# EAGLE design Dongle (EAGLE 7.5.0)
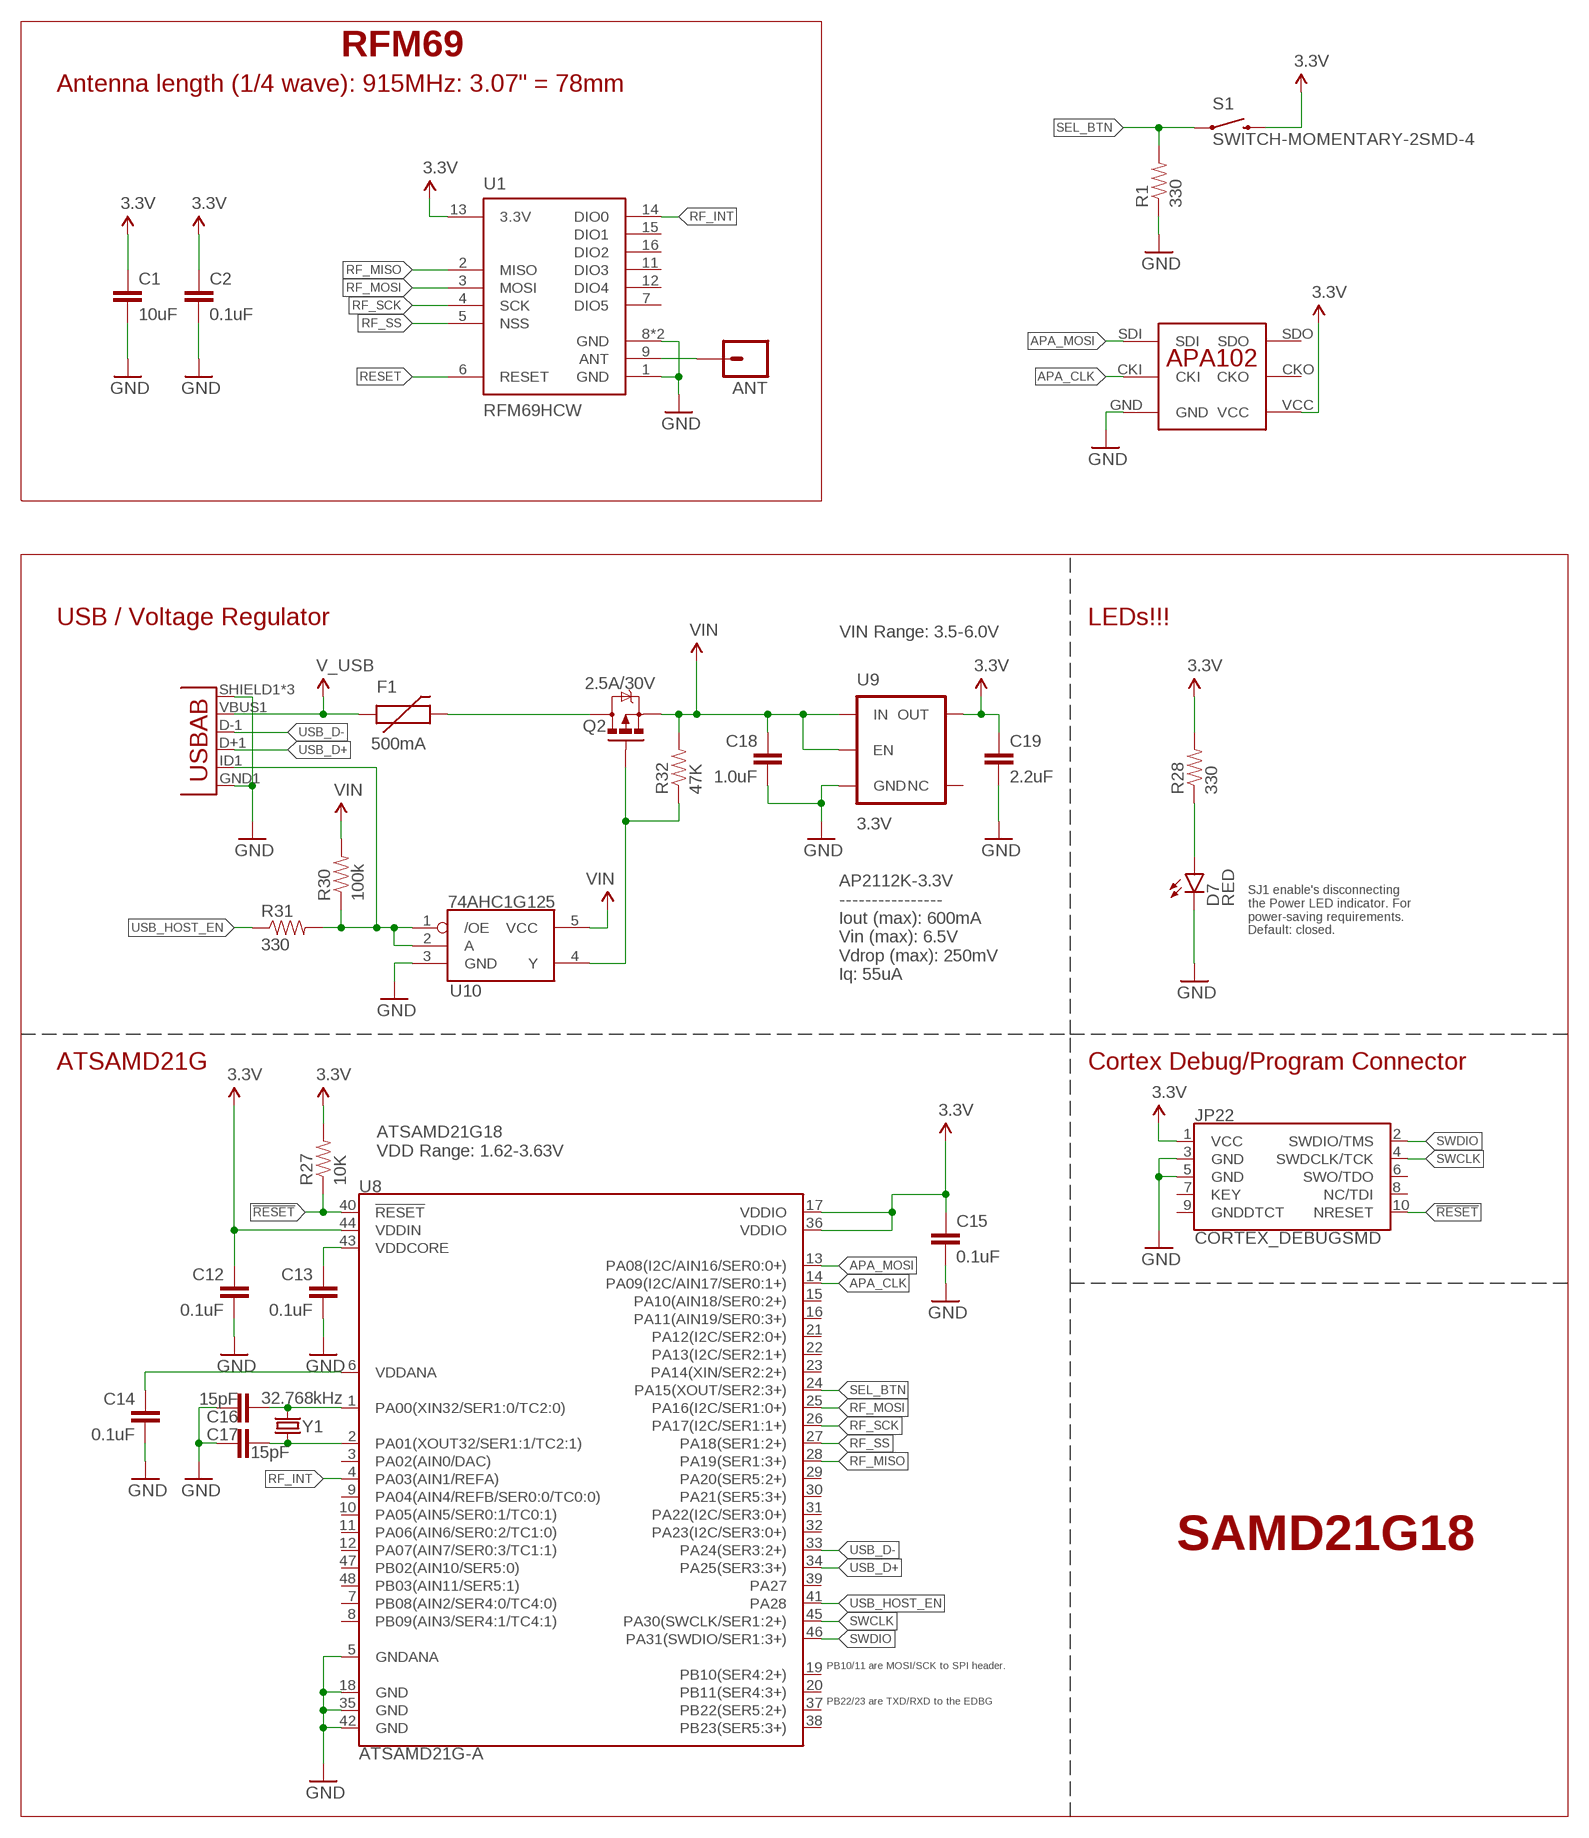
[diagram p0: schematic, sheet 1]

## Parts
ANT  M01PTH_NO_SILK_YES_STOP  [1X01_NO_SILK]
C1  10uF  10UF50V20%(1210)  [1210]
C2  0.1uF  0.1UF-25V(+80/-20%)(0603)  [0603-CAP@1]
C12  0.1uF  0.1UF-16V(+-10%)(0402)  [0402-CAP]
C13  0.1uF  0.1UF-16V(+-10%)(0402)  [0402-CAP]
C14  0.1uF  0.1UF-16V(+-10%)(0402)  [0402-CAP]
C15  0.1uF  0.1UF-16V(+-10%)(0402)  [0402-CAP]
C16  15pF  15PF-50V(+-5%)(0402)  [0402-CAP]
C17  15pF  15PF-50V(+-5%)(0402)  [0402-CAP]
C18  1.0uF  1.0UF-25V-+80/-20(0805)"  [0805-CAP]
C19  2.2uF  2.2UF-10V-20%(0603)  [0603-CAP]
D7  RED  LED-RED0603  [LED-0603]
F1  500mA  PTCSMD  [PTC-1206]
JP22  CORTEX_DEBUGSMD  [SAMTECH_FTSH-105-01]
JP23  USB-ABCONN-11794  [USB-AB-MICRO-SMD_V03]
Q2  2.5A/30V  MOSFET-PCHANNELDMG2307L  [SOT23-3]
R1  330  330OHM1/10W1%(0603)  [0603-RES]
R27  10K  10KOHM-1/10W-1%(0603)0603  [0603-RES]
R28  330  330OHM1/10W1%(0603)  [0603-RES]
R30  100k  100KOHM-1/10W-1%(0603)  [0603-RES]
R31  330  330OHM1/10W1%(0603)  [0603-RES]
R32  47K  47KOHM1/10W1%(0603)  [0603-RES]
S1  SWITCH-MOMENTARY-2SMD-4  [TACTILE_SWITCH_TALL]
U1  RFM69HCW  [RFM69HCW-XXXS2]
U8  ATSAMD21G-A  [TQFP-48]
U9  3.3V  V_REG_AP2112K-3.3V  [SOT23-5]
U10  74AHC1G125  [SOT23-5]
U$1  APA102  [APA102]
Y1  32.768kHz  CRYSTAL3.2X1.5MM  [CRYSTAL-SMD-3.2X1.5MM]

## Nets
3.3V: C1.1 C2.1 C12.1 C15.1 C19.1 JP22.1(VCC) R27.2 R28.2 S1.B2 U1.13(3.3V) U8.17(VDDIO) U8.36(VDDIO) U8.44(VDDIN) U9.5(OUT) U$1.VCC
!RESET: JP22.10(NRESET) R27.1 U8.40(!RESET!)
ANT: ANT.1 U1.9(ANT)
APA_CLK: U8.14(PA09(I2C/AIN17/SER0:1+)) U$1.CKI
APA_MOSI: U8.13(PA08(I2C/AIN16/SER0:0+)) U$1.SDI
GND: C1.2 C2.2 C12.2 C13.2 C14.2 C15.2 C16.1 C17.2 C18.2 C19.2 D7.C JP22.3(GND) JP22.5(GND) JP23.GND1(GND) JP23.SHIELD1(SHIELD) JP23.SHIELD2(SHIELD) JP23.SHIELD3(SHIELD) R1.1 U1.1(GND) U1.8(GND) U1.10(GND) U8.5(GNDANA) U8.18(GND) U8.35(GND) U8.42(GND) U9.2(GND) U10.3(GND) U$1.GND
N$10: C16.2 U8.1(PA00(XIN32/SER1:0/TC2:0)) Y1.P$2
N$13: C17.1 U8.2(PA01(XOUT32/SER1:1/TC2:1)) Y1.P$1
N$14: D7.A R28.1
N$18: F1.2 Q2.3(D)
N$19: JP23.ID1(USBID) R30.1 R31.2 U10.1(/OE) U10.2(A)
N$20: Q2.1(G) R32.1 U10.4(Y)
RESET: U1.6(RESET)
RF_INT: U1.14(DIO0) U8.4(PA03(AIN1/REFA))
RF_MISO: U1.2(MISO) U8.28(PA19(SER1:3+))
RF_MOSI: U1.3(MOSI) U8.25(PA16(I2C/SER1:0+))
RF_SCK: U1.4(SCK) U8.26(PA17(I2C/SER1:1+))
RF_SS: U1.5(NSS) U8.27(PA18(SER1:2+))
SEL_BTN: R1.2 S1.A2 U8.24(PA15(XOUT/SER2:3+))
SWCLK: JP22.4(SWDCLK/TCK) U8.45(PA30(SWCLK/SER1:2+))
SWDIO: JP22.2(SWDIO/TMS) U8.46(PA31(SWDIO/SER1:3+))
USB_D+: JP23.D+1(D+) U8.34(PA25(SER3:3+))
USB_D-: JP23.D-1(D-) U8.33(PA24(SER3:2+))
USB_HOST_EN: R31.1 U8.41(PA28)
V_USB: F1.1 JP23.VBUS1(VBUS)
VDDANA: C14.1 U8.6(VDDANA)
VDDCORE: C13.1 U8.43(VDDCORE)
VIN: C18.1 Q2.2(S) R30.2 R32.2 U9.1(IN) U9.3(EN) U10.5(VCC)
Unconnected: JP22.6(SWO/TDO) JP22.7(KEY) JP22.8(NC/TDI) JP22.9(GNDDTCT) U1.7(DIO5) U1.11(DIO3) U1.12(DIO4) U1.15(DIO1) U1.16(DIO2) U8.3(PA02(AIN0/DAC)) U8.7(PB08(AIN2/SER4:0/TC4:0)) U8.8(PB09(AIN3/SER4:1/TC4:1)) U8.9(PA04(AIN4/REFB/SER0:0/TC0:0)) U8.10(PA05(AIN5/SER0:1/TC0:1)) U8.11(PA06(AIN6/SER0:2/TC1:0)) U8.12(PA07(AIN7/SER0:3/TC1:1)) U8.15(PA10(AIN18/SER0:2+)) U8.16(PA11(AIN19/SER0:3+)) U8.19(PB10(SER4:2+)) U8.20(PB11(SER4:3+)) U8.21(PA12(I2C/SER2:0+)) U8.22(PA13(I2C/SER2:1+)) U8.23(PA14(XIN/SER2:2+)) U8.29(PA20(SER5:2+)) U8.30(PA21(SER5:3+)) U8.31(PA22(I2C/SER3:0+)) U8.32(PA23(I2C/SER3:0+)) U8.37(PB22(SER5:2+)) U8.38(PB23(SER5:3+)) U8.39(PA27) U8.47(PB02(AIN10/SER5:0)) U8.48(PB03(AIN11/SER5:1)) U9.4(NC) U$1.CKO U$1.SDO

## Notes on the sheet
- RFM69
- Antenna length (1/4 wave): 915MHz: 3.07" = 78mm
- USB / Voltage Regulator | LEDs!!!
- VIN Range: 3.5-6.0V
- AP2112K-3.3V
  ----------------
  Iout (max): 600mA 
  Vin (max): 6.5V
  Vdrop (max): 250mV
  Iq: 55uA
- SJ1 enable's disconnecting
  the Power LED indicator. For
  power-saving requirements.
  Default: closed.
- ATSAMD21G | Cortex Debug/Program Connector
- ATSAMD21G18
  VDD Range: 1.62-3.63V
- SAMD21G18
- PB10/11 are MOSI/SCK to SPI header.
- PB22/23 are TXD/RXD to the EDBG

## Library data of the parts
ANT = SparkFun-Connectors:M01: Header 1 Standard 1-pin 0.1" header. Use with straight break away headers (SKU : PRT-00116), right angle break away headers (PRT-00553), swiss pins (PRT-00743), machine pins (PRT-00117), and female headers (PRT-00115). SMTSO-256-ET is a "flush mount" nut for a 4-40 screw. The older package used to be too tight, and did not allow it to sit properly thru the drill hit. The latest (0.165DIA) fits nice and snug.
C1 = SparkFun-Capacitors:10UF50V20%(1210): CAP-09824; PROD_ID: CAP-09824
C2 = SparkFun-Capacitors:0.1UF-25V(+80/-20%)(0603): CAP-00810 Ceramic Standard decoupling cap; PROD_ID: CAP-00810
C12-C15 = SparkFun-Capacitors:0.1UF-16V(+-10%)(0402); PROD_ID: CAP-12416
C16 C17 = samd21-temp:15PF-50V(+-5%)(0402); PROD_ID: CAP-13063
C18 = SparkFun-Capacitors:1.0UF-25V-+80/-20(0805): CAP-11625; PROD_ID: CAP-11625
C19 = SparkFun-Capacitors:2.2UF-10V-20%(0603): CAP-07888; PROD_ID: CAP-07888
D7 = SparkFun-LED:LED-RED: Assorted Red LEDs LilyPad 1206- DIO-09912 1206- DIO-00809 0603- DIO-00819 "SMART" means more efficient and expensive; PROD_ID: DIO-00819
F1 = SparkFun-PowerIC:PTC: Resettable Fuse PTC Resettable Fuse. Spark Fun Electronics SKU : COM-08357; PROD_ID: RES-11150
JP22 = SparkFun-Connectors:CORTEX_DEBUG: Cortex Debug Connector Datasheet <http://infocenter.arm.com/help/topic/com.arm.doc.faqs/attached/13634/cortex_debug_connectors.pdf>
JP23 = SparkFun-Connectors:USB-AB: This is a USB AB connector that is compatible with USB OTG. i.e. this connector can serve as a host or device; PROD_ID: CONN-11794
Q2 = SparkFun-DiscreteSemi:MOSFET-PCHANNEL: Generic PMOSFET IRLML2244 - TRANS-11153 (SOT-23 -20V -4.3A) (1.Gate 2.Source 3.Drain) FQP27P06 - COM-10349 <http://www.sparkfun.com/products/10349> (TO-220 -60V -27A) (1.Gate 2.Source 3.Drain); PROD_ID: TRANS-11308
R1 R28 R31 = SparkFun-Resistors:330OHM1/10W1%(0603): RES-00818; PROD_ID: RES-00818
R27 = SparkFun-Resistors:10KOHM-1/10W-1%(0603): RES-00824; PROD_ID: RES-00824
R30 = SparkFun-Resistors:100KOHM-1/10W-1%(0603): RES-07828; PROD_ID: RES-07828
R32 = SparkFun-Resistors:47KOHM1/10W1%(0603): RES-07871; PROD_ID: RES-07871
S1 = SparkFun-Electromechanical:SWITCH-MOMENTARY-2: Various NO switches- pushbuttons, reed, etc; PROD_ID: SWCH-11966
U1 = mike-temp:RFM69H
U8 = samd21-temp:ATSAMD21G: Atmel SAMD21G SMART ARM-Based Microcontroller The Atmel ® | SMART ™ SAM D21 is a series of low-power microcontrollers using the 32-bit ARM ® Cortex ® -M0+ processor, and ranging from 32- to 64-pins with up to 256KB Flash and 32KB of SRAM. The SAM D21 devices operate at a maximum frequency of 48MHz and reach 2.46 CoreMark/MHz. They are designed for simple and intuitive migration with identical peripheral modules, hex compatible code, identical linear address map and pin compatible migration paths between all devices in the product series. All devices include intelligent and flexible peripherals, Atmel Event System for inter-peripheral signaling, and support for capacitive touch button, slider and wheel user interfaces.; PROD_ID: IC-13064
U9 = SparkFun-PowerIC:V_REG_AP2112: AP2112 - 600mA CMOS LDO Regulator w/ Enable The AP2112 is CMOS process low dropout linear regulator with enable function, the regulator delivers a guaranteed 600mA (min.) continuous load current. Features Output Voltage Accuracy: ±1.5% Output Current: 600mA (Min.) Foldback Short Current Protection: 50mA Enable Function to Turn ON/OFF VOUT Low Dropout Voltage (3.3V): 250mV (Typ.) @IOUT=600mA Excellent Load Regulation: 0.2%/A (Typ.) Excellent Line Regulation: 0.02%/V (Typ.) Low Quiescent Current: 55μA (Typ.) Low Standby Current: 0.01μA (Typ.) Low Output Noise: 50μVRMS PSRR: 100Hz -65dB, 1kHz -65dB OTSD Protection Stable with 1.0μF Flexible Cap: Ceramic, Tantalum and Aluminum Electrolytic Operation Temperature Range: -40°C to 85°C ESD: MM 400V, HBM 4000V; PROD_ID: VREG-12457
U10 = SparkFun-DigitalIC:74AHC1G125: Single bus buffer gate with 3-state output; PROD_ID: IC-11920
U$1 = SAUVE:APA102
Y1 = samd21-temp:CRYSTAL: Various standard crystals. Proven footprints.; PROD_ID: XTAL-13062

## Board
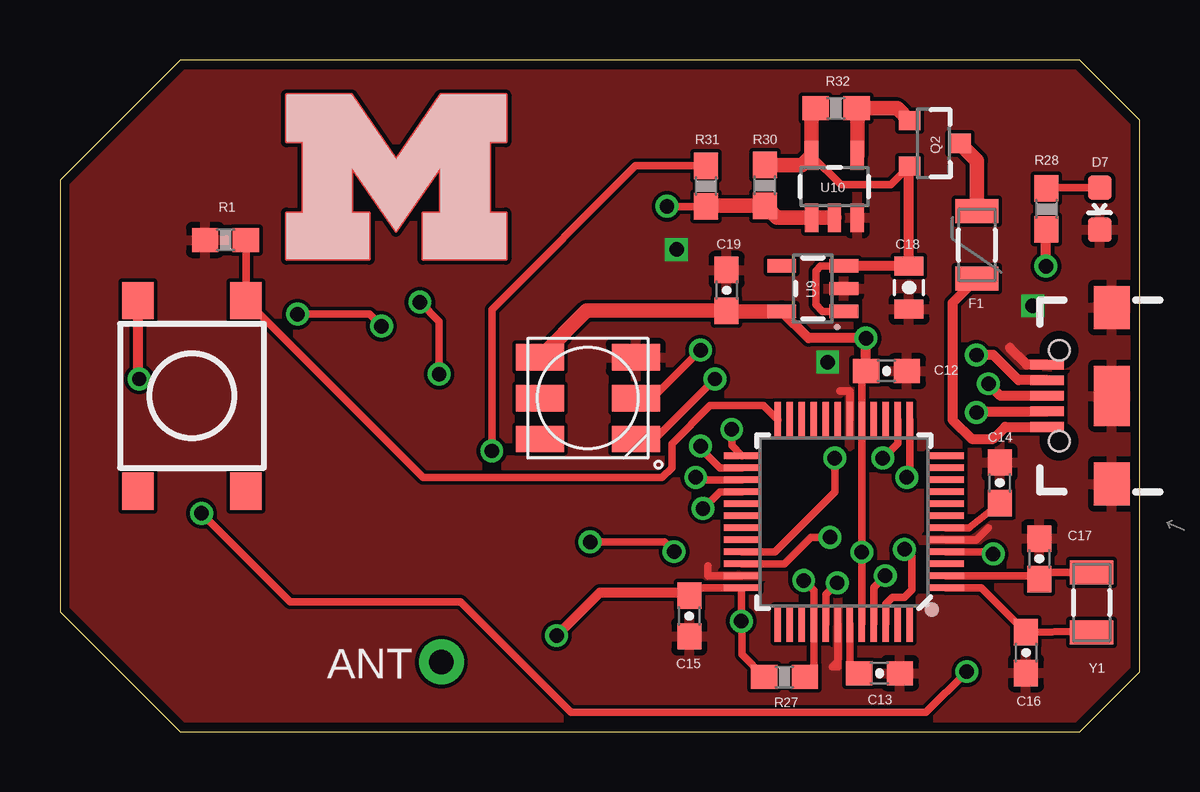
[diagram p1: board, top side]
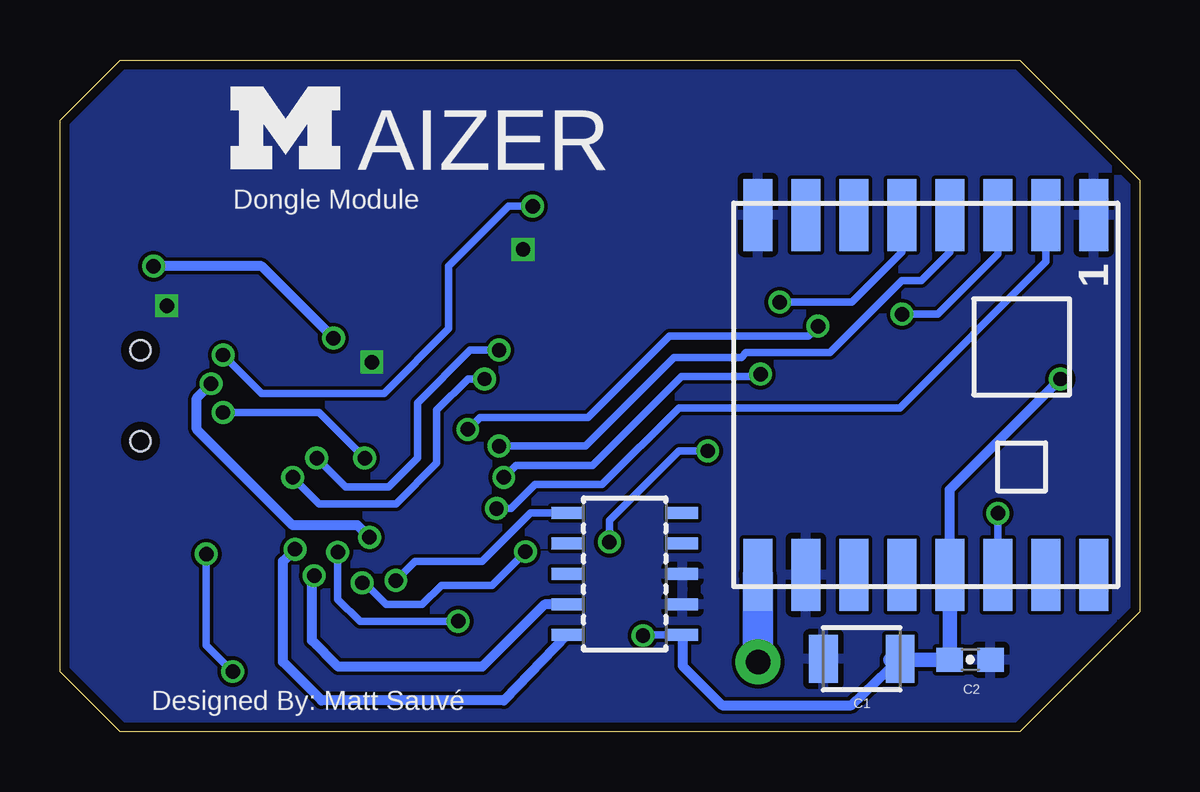
[diagram p2: board, bottom side, seen from below]

Size 45 x 28 mm. Coordinates in mm from the lower left corner, seen from the top.
Outline: 0,23 0,5 5,0 42.5,0 45,2.5 45,25.5 42.5,28 5,28 0,23
Copper layers (1*16): Top 0.0356mm / dielectric 1.5011mm / Bottom 0.0356mm
Design rules "oshpark-2layer": minimum track width 6mil, minimum drill 13mil, track to track 6mil, track to pad 6mil, pad to pad 6mil, via to via 6mil, smd to smd 6mil, copper to edge 15mil, drill to drill 6mil, minimum pad ring 7mil, minimum via ring 7mil, stop-mask expansion 2.5mil, vias tented up to drill 0mil, thermal gap 10mil

### Footprints (pad centres in the part's own frame; a part is rotated, then mirrored left to right if it is on the bottom)
1X01_NO_SILK = drill 1.016 pad 1.88: 1 0,0
1210 = smd 1.2 x 2: 1 -1.6,0; 2 1.6,0
0603-CAP = smd 1.1 x 1: 1 -0.85,0; 2 0.85,0
0805-CAP = smd 0.8 x 1.2: 1 -0.9,0; 2 0.9,0
LED-0603 = smd 1 x 1: A 0,-0.877; C 0,0.877
PTC-1206 = smd 1 x 1.8: 1 -1.4,0; 2 1.4,0
SAMTECH_FTSH-105-01 = smd 0.508 x 1.27: 1 -2.54,-2.413; 2 -2.54,2.413; 3 -1.27,-2.413; 4 -1.27,2.413; 5 0,-2.413; 6 0,2.413; 7 1.27,-2.413; 8 1.27,2.413; 9 2.54,-2.413; 10 2.54,2.413
USB-AB-MICRO-SMD_V03 = smd 1.4 x 0.4: D+1 2.7,0; D-1 2.7,0.65; GND1 2.7,-1.3; ID1 2.7,-0.65; VBUS1 2.7,1.3 | smd 1.5 x 1.8: SHIELD1 0,3.68; SHIELD3 0,-3.68 | smd 1.5 x 2.5: SHIELD2 0,0 | hole 0.85: 2.2,1.9; 2.2,-1.9
SOT23-3 = smd 0.8 x 0.9: 1 -0.95,-1; 2 0.95,-1; 3 0,1.1
0603-RES = smd 1.1 x 1: 1 -0.85,0; 2 0.85,0
TACTILE_SWITCH_TALL = smd 1.55 x 1.3: A1 -3.975,-2.25; A2 3.975,-2.25; B1 -3.975,2.25; B2 3.975,2.25
RFM69HCW-XXXS2 = smd 3 x 1.2: 1 -7.5,7; 2 -7.5,5; 3 -7.5,3; 4 -7.5,1; 5 -7.5,-1; 6 -7.5,-3; 7 -7.5,-5; 8 -7.5,-7; 9 7.5,-7; 10 7.5,-5; 11 7.5,-3; 12 7.5,-1; 13 7.5,1; 14 7.5,3; 15 7.5,5; 16 7.5,7
TQFP-48 = smd 1.5 x 0.28: 1 -4.25,2.75; 2 -4.25,2.25; 3 -4.25,1.75; 4 -4.25,1.25; 5 -4.25,0.75; 6 -4.25,0.25; 7 -4.25,-0.25; 8 -4.25,-0.75; 9 -4.25,-1.25; 10 -4.25,-1.75; 11 -4.25,-2.25; 12 -4.25,-2.75; 25 4.25,-2.75; 26 4.25,-2.25; 27 4.25,-1.75; 28 4.25,-1.25; 29 4.25,-0.75; 30 4.25,-0.25; 31 4.25,0.25; 32 4.25,0.75; 33 4.25,1.25; 34 4.25,1.75; 35 4.25,2.25; 36 4.25,2.75 | smd 0.28 x 1.5: 13 -2.75,-4.25; 14 -2.25,-4.25; 15 -1.75,-4.25; 16 -1.25,-4.25; 17 -0.75,-4.25; 18 -0.25,-4.25; 19 0.25,-4.25; 20 0.75,-4.25; 21 1.25,-4.25; 22 1.75,-4.25; 23 2.25,-4.25; 24 2.75,-4.25; 37 2.75,4.25; 38 2.25,4.25; 39 1.75,4.25; 40 1.25,4.25; 41 0.75,4.25; 42 0.25,4.25; 43 -0.25,4.25; 44 -0.75,4.25; 45 -1.25,4.25; 46 -1.75,4.25; 47 -2.25,4.25; 48 -2.75,4.25
SOT23-5 = smd 0.55 x 1.2: 1 -0.95,-1.3; 2 0,-1.3; 3 0.95,-1.3; 4 0.95,1.3; 5 -0.95,1.3
APA102 = smd 2 x 1.1: CKI -2,0; CKO 2,0; GND -2,-1.7; SDI -2,1.7; SDO 2,1.7; VCC 2,-1.7
CRYSTAL-SMD-3.2X1.5MM = smd 1 x 1.8: P$1 -1.25,0; P$2 1.25,0

### Placement (x,y rotation side)
ANT  15.9,2.9 0 top
C1  11.58,3.03 180 bottom
C2  0.1uF  [0603-CAP]  7.06,3 0 bottom
C12  0.1uF  [0603-CAP]  34.45,15.03 0 top
C13  0.1uF  [0603-CAP]  34.16,2.43 0 top
C14  0.1uF  [0603-CAP]  39.17,10.37 90 top
C15  0.1uF  [0603-CAP]  26.23,4.82 270 top
C16  15pF  [0603-CAP]  40.27,3.29 90 top
C17  15pF  [0603-CAP]  40.83,7.2 90 top
C18  35.39,18.51 270 top
C19  27.79,18.4 90 top
D7  GREEN  [LED-0603]  43.34,21.8 180 top
F1  38.22,20.29 90 top
JP22  21.46,6.57 90 bottom
JP23  43.85,14 180 top
Q2  36.41,24.52 270 top
R1  6.9,20.5 0 top
R27  30.2,2.28 180 top
R28  41.12,21.79 270 top
R30  29.38,22.77 90 top
R31  26.92,22.74 270 top
R32  32.35,25.98 180 top
S1  5.5,14 90 top
U1  8.91,14.04 270 bottom
U8  32.67,8.75 180 top
U9  31.38,18.47 90 top
U10  32.28,22.72 0 top
U$1  22,13.9 180 top
U$2  [BLOCK-M-5MM]  35.6,25.1 0 bottom
U$4  [BLOCK-M-10MM-MASK]  14,23 0 top
Y1  43,5.38 270 top

### Tracks (layer width: path | path; a pad name or v marks a point on that pad's centre or on a via)
3.3V  (via drill 0.6)
  Top 0.305: 26.53,6 C15.1 26.56,6 U8.36 28.4,5.98 v28.4,4.6 28.42,4.58 28.42,3.21 R27.2 | U8.44 v33.42,7.48 33.4,7.5 33.42,7.52 U8.17 33.42,15.08 33.64,15.3 33.6,15.34
  Top 0.406: v20.7,4 22.5,5.8 26.1,5.8 C15.1 | v3.3,14.7 3.25,14.75 S1.B2 | 30.08,17.42 U9.5 31.2,16.4 v33.6,16.4 33.6,15.34 | v41.1,19.4 41.1,20.92 R28.2 | 33.64,15.3 C12.1
  Top 0.61: U9.5 27.82,17.52 C19.1 21.95,17.55 U$1.VCC
  Bottom 0.305: v33.42,7.48 33.42,5.52 32.5,4.6 v28.4,4.6 | v20.7,4 20.7,4.03 JP22.1
  Bottom 0.406: JP22.1 19.05,2.75 17.4,1.1 12.01,1.1 C1.1 | U1.13 7.91,10.09 v3.3,14.7 | v33.6,16.4 36.6,19.4 v41.1,19.4
  Bottom 0.61: U1.13 C2.1 10.38,3 C1.1
!RESET  (via drill 0.6)
  Top 0.305: R27.1 31.42,2.65 U8.40 31.42,5.88 v31,6.3
  Bottom 0.305: JP22.10 25.39,9.11 27.4,7.1 30.2,7.1 v31,6.3
ANT
  Bottom 1.27: U1.9 15.91,3.39 arc90 ANT.1
APA_CLK  (via drill 0.6)
  Top 0.305: U8.14 34.92,12.02 v34.3,11.4 | v26.7,15.9 24.7,13.9 U$1.CKI
  Bottom 0.305: v26.7,15.9 27.9,15.9 30.1,13.7 30.1,11.4 31.3,10.2 33.1,10.2 v34.3,11.4
APA_MOSI  (via drill 0.6)
  Top 0.305: U8.13 35.42,10.72 v35.3,10.6 | v27.3,14.7 24.8,12.2 U$1.SDI
  Bottom 0.305: v27.3,14.7 28,14.7 29.3,13.4 29.3,11.2 31,9.5 34.2,9.5 v35.3,10.6
GND  (via drill 0.6)
  Top 0.305: U8.42 32.42,2.7 32.2,2.7 32.4,2.9 | U8.35 27,6.5 27,6.9 | U8.18 32.92,14.2 32.5,14.2 | U8.5 38.2,8 38.7,8.5
  Top 0.406: JP23.GND1 40.3,15.3 39.6,16
  other vias: 25.7,20.1 40.55,17.75 32,15.4
  pour Bottom: 42.5,0 5,0 0,5 0,23 5,28 42.5,28 45,25.5 45,2.5
  pour Top: 42.5,0 5,0 0,5 0,23 5,28 42.5,28 45,25.5 45,2.5
N$10
  Top 0.305: Y1.P$2 42.56,4.17 C16.2 38.41,6 U8.1
N$13
  Top 0.305: Y1.P$1 41.14,6.63 C17.1 40.41,6.5 U8.2
N$14
  Top 0.305: R28.1 41.16,22.68 D7.A
N$18
  Top 0.61: F1.2 38.22,23.81 Q2.3
N$19  (via drill 0.6)
  Top 0.305: R31.2 v25.31,21.89 v25.3,21.9
  Top 0.406: JP23.ID1 39.95,14.65 38.9,15.7 v38.2,15.7
  Top 0.61: R31.2 26.95,21.92 R30.1 29.88,21.42 U10.1 U10.2
  Bottom 0.305: v38.2,15.7 36.6,14.1 31.5,14.1 28.8,16.8 28.8,19.4 26.3,21.9 v25.3,21.9
N$20
  Top 0.61: Q2.1 34.9,25.98 R32.1 33.23,25.95 U10.4
RF_INT  (via drill 0.6)
  Top 0.305: v38.9,7.4 38.8,7.5 U8.4 | v5.9,9.1 9.6,5.4 16.7,5.4 21.3,0.8 36.1,0.8 v37.8,2.5
  Bottom 0.305: U1.14 v5.9,9.1 | v37.8,2.5 38.9,3.6 v38.9,7.4
RF_MISO  (via drill 0.6)
  Top 0.305: U8.28 27.5,10 v26.8,9.3
  Bottom 0.305: v26.8,9.3 26.2,9.3 25.2,10.3 22.4,10.3 19.2,13.5 10,13.5 3.9,19.6 U1.2
RF_MOSI  (via drill 0.6)
  Top 0.305: U8.25 28,11.92 v28,12.6 | v9.9,17.4 12.9,17.4 v13.4,16.9
  Bottom 0.305: v28,12.6 27.5,13.1 23,13.1 19.6,16.5 13.8,16.5 v13.4,16.9 | v9.9,17.4 8.4,17.4 5.9,19.9 U1.3
RF_SCK  (via drill 0.6)
  Top 0.305: U8.26 27.5,11 26.7,11.8 v26.7,11.9
  Bottom 0.305: v26.7,11.9 23.1,11.9 19.4,15.6 16.6,15.6 16.4,15.8 12.9,15.8 9.9,18.8 9.1,18.8 7.9,20 U1.4
RF_SS  (via drill 0.6)
  Top 0.305: U8.27 26.6,10.5 v26.5,10.6 | v15.8,14.9 15.8,17.1 v15,17.9
  Bottom 0.305: v26.5,10.6 26,11.1 22.8,11.1 19.1,14.8 15.9,14.8 v15.8,14.9 | U1.5 9.9,20 12,17.9 v15,17.9
SEL_BTN
  Top 0.305: R1.2 S1.A2 15.12,10.6 25.1,10.6 25.5,11 25.5,12 27.1,13.6 29.32,13.6 U8.24
SWCLK  (via drill 0.6)
  Top 0.305: U8.45 33.92,6.02 v34.4,6.5
  Bottom 0.406: JP22.4 24.8,5.3 27.4,2.7 33.4,2.7 34.5,3.8 34.5,6.4 v34.4,6.5
SWDIO  (via drill 0.6)
  Top 0.305: U8.46 34.42,5.32 34.7,5.6 35.2,5.6 35.5,5.9 35.5,7.3 v35.2,7.6
  Bottom 0.406: JP22.2 26.5,1.3 34.1,1.3 35.7,2.9 35.7,7.1 v35.2,7.6
USB_D+  (via drill 0.6)
  Top 0.305: U8.34 30.2,7 31.3,8.1 v32.1,8.1
  Top 0.406: JP23.D+1 39.2,14 v38.7,14.5
  Bottom 0.406: v32.1,8.1 32.6,8.6 35.3,8.6 39.3,12.6 39.3,13.9 v38.7,14.5
USB_D-  (via drill 0.6)
  Top 0.305: U8.33 29.8,7.5 32.3,10 v32.3,11.4
  Top 0.406: v38.2,13.3 38.25,13.35 JP23.D-1
  Bottom 0.305: v38.2,13.3 34.2,13.3 v32.3,11.4
USB_HOST_EN  (via drill 0.6)
  Top 0.305: U8.41 31.92,5.72 v32.4,6.2 | R31.1 23.99,23.59 18,17.6 v18,11.7 | v22.1,7.9 25.2,7.9 v25.6,7.5
  Bottom 0.305: v25.6,7.5 27,6.1 29.1,6.1 29.9,5.3 31.4,5.3 32.3,6.2 v32.4,6.2 | v18,11.7 19.2,11.7 22.1,8.8 v22.1,7.9
V_USB
  Top 0.406: F1.1 37.2,17.87 37.2,13 38,12.2 38.9,12.2 39.4,12.7 JP23.VBUS1
VDDANA
  Top 0.305: C14.1 37.88,8.5 U8.6
VDDCORE
  Top 0.305: C13.1 32.92,2.49 U8.43
VIN
  Top 0.305: Q2.2 34.64,22.8 32.55,22.8 U10.5 | U9.1 31.78,17.52 31.5,17.8 31.5,19.2 31.7,19.4 32.66,19.4 U9.3
  Top 0.406: Q2.2 35.39,23.55 C18.1 U9.3
  Top 0.61: R32.2 31.33,25.81 U10.5 30.93,23.62 R30.2

### Text on the board
bPlace: AIZER | Dongle Module | Designed By: Matt Sauvé